# EAGLE design 16x16base (EAGLE 5.06)
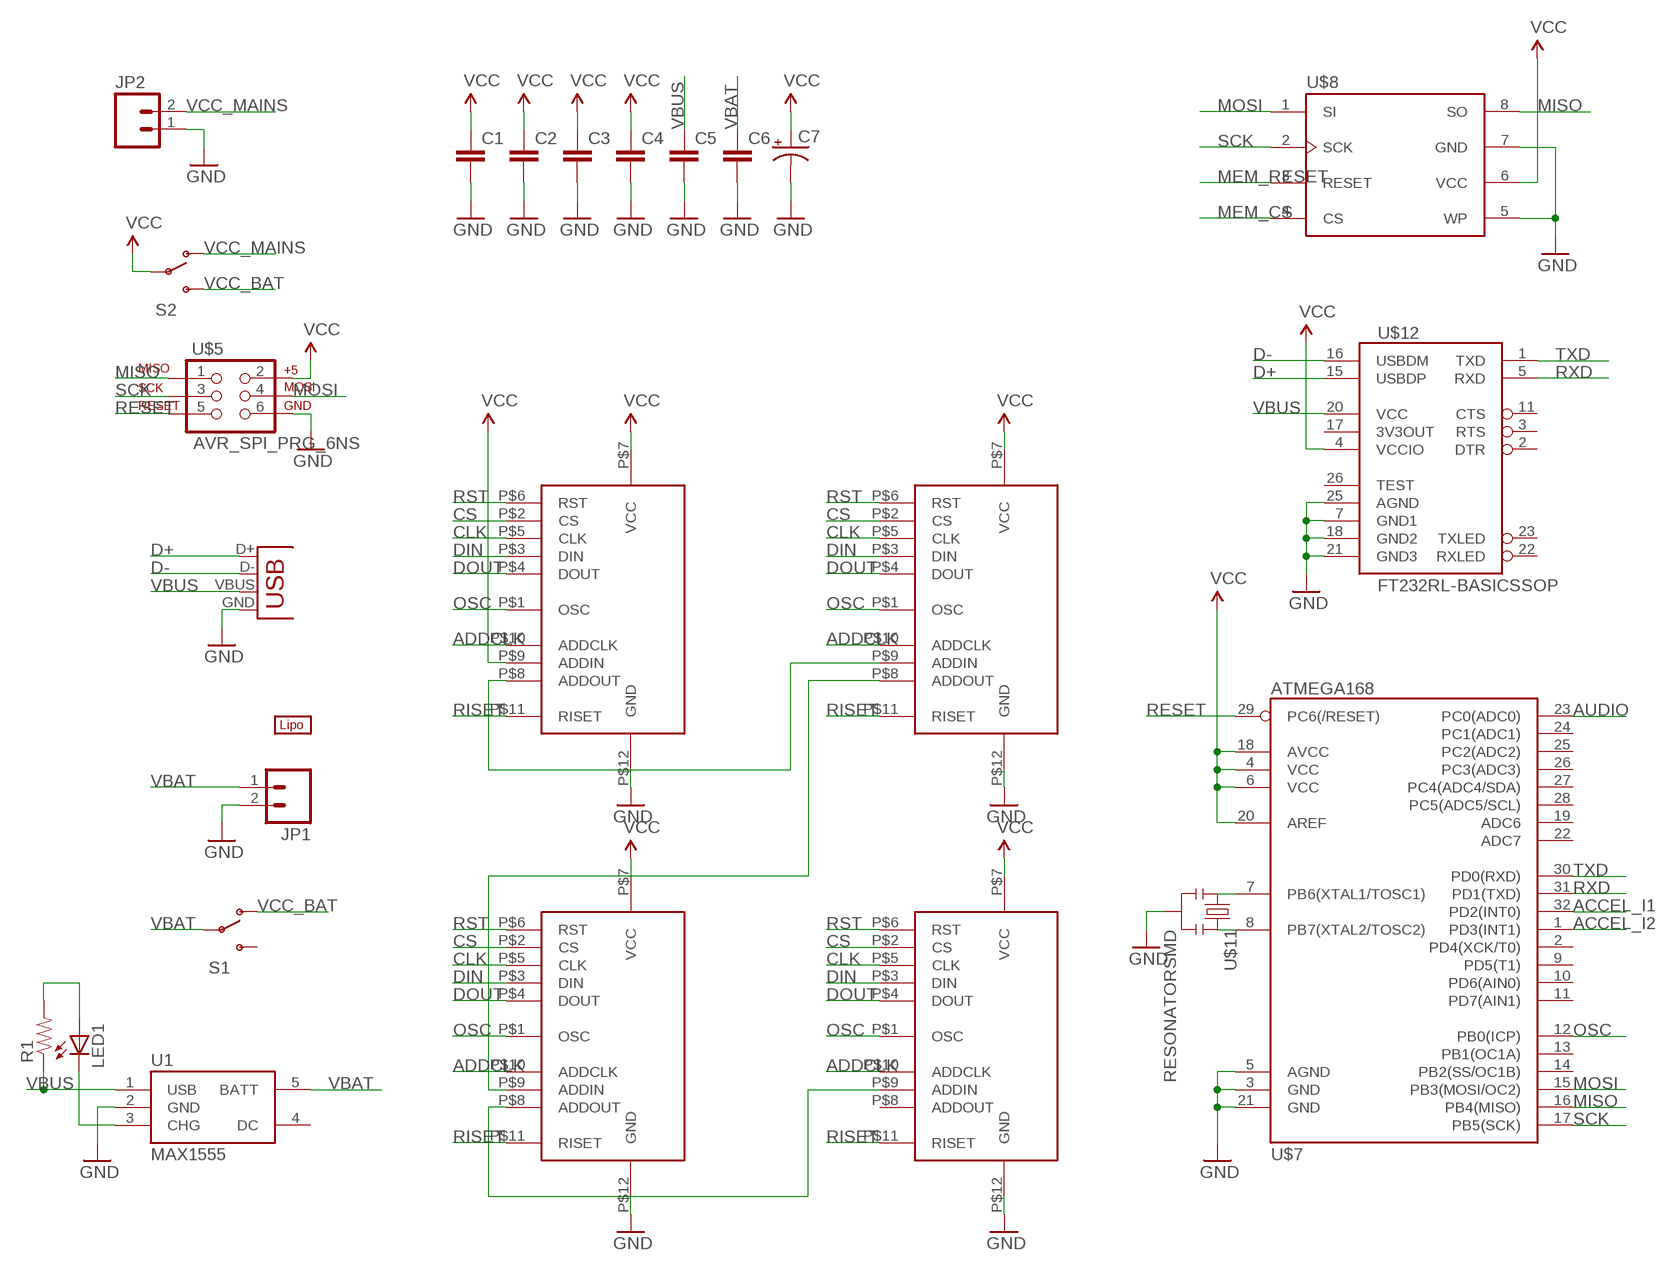
[diagram p0: schematic, sheet 1]

## Parts
C1  CAP0603  [0603]
C2  CAP0603  [0603]
C3  CAP0603  [0603]
C4  CAP0603  [0603]
C5  CAP0603  [0603]
C6  CAP0603  [0603]
C7  CAP_POL3528  [EIA3528]
JP1  M02-JST-2MM-SMT  [S2B-PH]
JP2  M02PTH  [1X02]
LED1  LED0603  [LED-0603]
R1  RESISTOR0603  [0603]
S1  SWITCH-SPSTSMD2  [SWITCH-SPDT-SMD]
S2  SWITCH-SPSTSMD2  [SWITCH-SPDT-SMD]
U1  MAX1555  [SOT23-5]
U$1  DISPLAY_TILE  [DISPLAY_TILE]
U$2  DISPLAY_TILE  [DISPLAY_TILE]
U$3  DISPLAY_TILE  [DISPLAY_TILE]
U$4  DISPLAY_TILE  [DISPLAY_TILE]
U$5  AVR_SPI_PRG_6NS  [2X3-NS]
U$6  LIPO-OUTLINE2000  [LIPO-2000]
U$7  ATMEGA168  [TQFP32-08]
U$8  ATMEL_DATA_FLASH  [SO08WIDE]
U$11  RESONATORSMD  [RESONATOR-SMD]
U$12  FT232RL-BASICSSOP  [SSOP28DB]
X1  USBSMD  [USB-MINIB]

## Nets
ACCEL_I1: U$7.32(PD2(INT0))
ACCEL_I2: U$7.1(PD3(INT1))
ADDCLK: U$1.P$10(ADDCLK) U$2.P$10(ADDCLK) U$3.P$10(ADDCLK) U$4.P$10(ADDCLK)
AUDIO: U$7.23(PC0(ADC0))
CLK: U$1.P$5(CLK) U$2.P$5(CLK) U$3.P$5(CLK) U$4.P$5(CLK)
CS: U$1.P$2(CS) U$2.P$2(CS) U$3.P$2(CS) U$4.P$2(CS)
D+: U$12.15(USBDP) X1.D+
D-: U$12.16(USBDM) X1.D-
DIN: U$1.P$3(DIN) U$2.P$3(DIN) U$3.P$3(DIN) U$4.P$3(DIN)
DOUT: U$1.P$4(DOUT) U$2.P$4(DOUT) U$3.P$4(DOUT) U$4.P$4(DOUT)
GND: C1.2 C2.2 C3.2 C4.2 C5.2 C6.2 C7.C(-) JP1.2 JP2.1 U1.2(GND) U$1.P$12(GND) U$2.P$12(GND) U$3.P$12(GND) U$4.P$12(GND) U$5.6 U$7.3(GND) U$7.5(AGND) U$7.21(GND) U$8.5(WP) U$8.7(GND) U$11.2 U$12.7(GND1) U$12.18(GND2) U$12.21(GND3) U$12.25(AGND) X1.GND
MEM_CS: U$8.4(CS)
MEM_RESET: U$8.3(RESET)
MISO: U$5.1 U$7.16(PB4(MISO)) U$8.8(SO)
MOSI: U$5.4 U$7.15(PB3(MOSI/OC2)) U$8.1(SI)
N$1: U$1.P$8(ADDOUT) U$2.P$9(ADDIN)
N$2: U$2.P$8(ADDOUT) U$3.P$9(ADDIN)
N$3: U$3.P$8(ADDOUT) U$4.P$9(ADDIN)
N$4: U$7.8(PB7(XTAL2/TOSC2)) U$11.3
N$5: LED1.C U1.3(CHG)
N$6: LED1.A R1.2
N$8: U$7.7(PB6(XTAL1/TOSC1)) U$11.1
OSC: U$1.P$1(OSC) U$2.P$1(OSC) U$3.P$1(OSC) U$4.P$1(OSC) U$7.12(PB0(ICP))
RESET: U$5.5 U$7.29(PC6(/RESET))
RISET: U$1.P$11(RISET) U$2.P$11(RISET) U$3.P$11(RISET) U$4.P$11(RISET)
RST: U$1.P$6(RST) U$2.P$6(RST) U$3.P$6(RST) U$4.P$6(RST)
RXD: U$7.31(PD1(TXD)) U$12.5(RXD)
SCK: U$5.3 U$7.17(PB5(SCK)) U$8.2(SCK)
TXD: U$7.30(PD0(RXD)) U$12.1(TXD)
VBAT: C6.1 JP1.1 S1.2(P) U1.5(BATT)
VBUS: C5.1 R1.1 U1.1(USB) U$12.20(VCC) X1.VBUS
VCC: C1.1 C2.1 C3.1 C4.1 C7.A(+) S2.2(P) U$1.P$7(VCC) U$1.P$9(ADDIN) U$2.P$7(VCC) U$3.P$7(VCC) U$4.P$7(VCC) U$5.2 U$7.4(VCC) U$7.6(VCC) U$7.18(AVCC) U$7.20(AREF) U$8.6(VCC) U$12.4(VCCIO)
VCC_BAT: S1.1(O) S2.3(S)
VCC_MAINS: JP2.2 S2.1(O)
Unconnected: S1.3(S) U1.4(DC) U$4.P$8(ADDOUT) U$7.2(PD4(XCK/T0)) U$7.9(PD5(T1)) U$7.10(PD6(AIN0)) U$7.11(PD7(AIN1)) U$7.13(PB1(OC1A)) U$7.14(PB2(SS/OC1B)) U$7.19(ADC6) U$7.22(ADC7) U$7.24(PC1(ADC1)) U$7.25(PC2(ADC2)) U$7.26(PC3(ADC3)) U$7.27(PC4(ADC4/SDA)) U$7.28(PC5(ADC5/SCL)) U$12.2(DTR) U$12.3(RTS) U$12.11(CTS) U$12.17(3V3OUT) U$12.22(RXLED) U$12.23(TXLED) U$12.26(TEST)

## Library data of the parts
C1-C6 = SparkFun:CAP: Capacitor Standard 0603 ceramic capacitor, and 0.1" leaded capacitor.
C7 = SparkFun:CAP_POL: Capacitor Polarized These are standard SMD and PTH capacitors. Normally 10uF, 47uF, and 100uF in electrolytic and tantalum varieties. Always verify the external diameter of the through hole cap, it varies with capacity, voltage, and manufacturer. The EIA devices should be standard.
JP1 JP2 = SparkFun:M02: Header 2 Standard 2-pin 0.1" header. Use with straight break away headers (SKU : PRT-00116), right angle break away headers (PRT-00553), swiss pins (PRT-00743), machine pins (PRT-00117), and female headers (PRT-00115). Molex polarized connector foot print use with SKU : PRT-08233 with associated crimp pins and housings.
LED1 = SparkFun:LED: LEDs Standard schematic elements and footprints for 5mm, 3mm, 1206, and 0603 sized LEDs. 5mm - Spark Fun Electronics SKU : COM-00529 (and others)
R1 = SparkFun:RESISTOR: Resistor Basic schematic elements and footprints for 0603, 1206, and PTH 1/10th watt (small) resistors.
S1 S2 = SparkFun:SWITCH-SPST: SPST Switch Simple slide switch. Spark Fun Electronics SKU : COM-00102
U1 = SparkFun:MAX1555: MAX1555 Lithium Charger IC SOT-23 Lithium Polymer charging IC. Schematic element and footprint proven. Spark Fun Electronics SKU : COM-00674
U$1-U$4 = john:DISPLAY_TILE
U$5 = SparkFun:AVR_SPI_PRG_6: AVR ISP 6 Pin This is the reduced ISP connector for AVR programming. Common on Arduino. This footprint will take up less PCB space and can be used with a 10-pin to 6-pin adapter such as SKU: BOB-08508
U$6 = SparkFun:LIPO-OUTLINE
U$7 = SparkFun:ATMEGA168
U$8 = SparkFun:ATMEL_DATA_FLASH: 16Mbit EEPROM DataFlash Footprint needs touching up. Spark Fun Electronics SKU : COM-00301
U$11 = SparkFun:RESONATOR: Resonator Small SMD resonator. This is the itty bitty 10/20MHz resonators with built in caps. CSTCE10M0G55 and CSTCE20M0V53. Footprint has been reviewed closely but hasn't been tested yet.
U$12 = SparkFun:FT232RL-BASIC: USB UART This is the simplified version of the FT232RL unit. Only what you need, nothing you don't. Spark Fun Electronics SKU : COM-00650
X1 = SparkFun:USB: USB Connectors USB-B-PTH is fully proven SKU : PRT-00139 USB-miniB is fully proven SKU : PRT-00587 USB-A-PCB is untested. USB-A-H is throughly reviewed, but untested. Spark Fun Electronics SKU : PRT-00437 USB-B-SMT is throughly reviewed, but untested. Needs silkscreen touching up. USB-A-S has not been used/tested USB-MB-H has not been used/tested

## Board
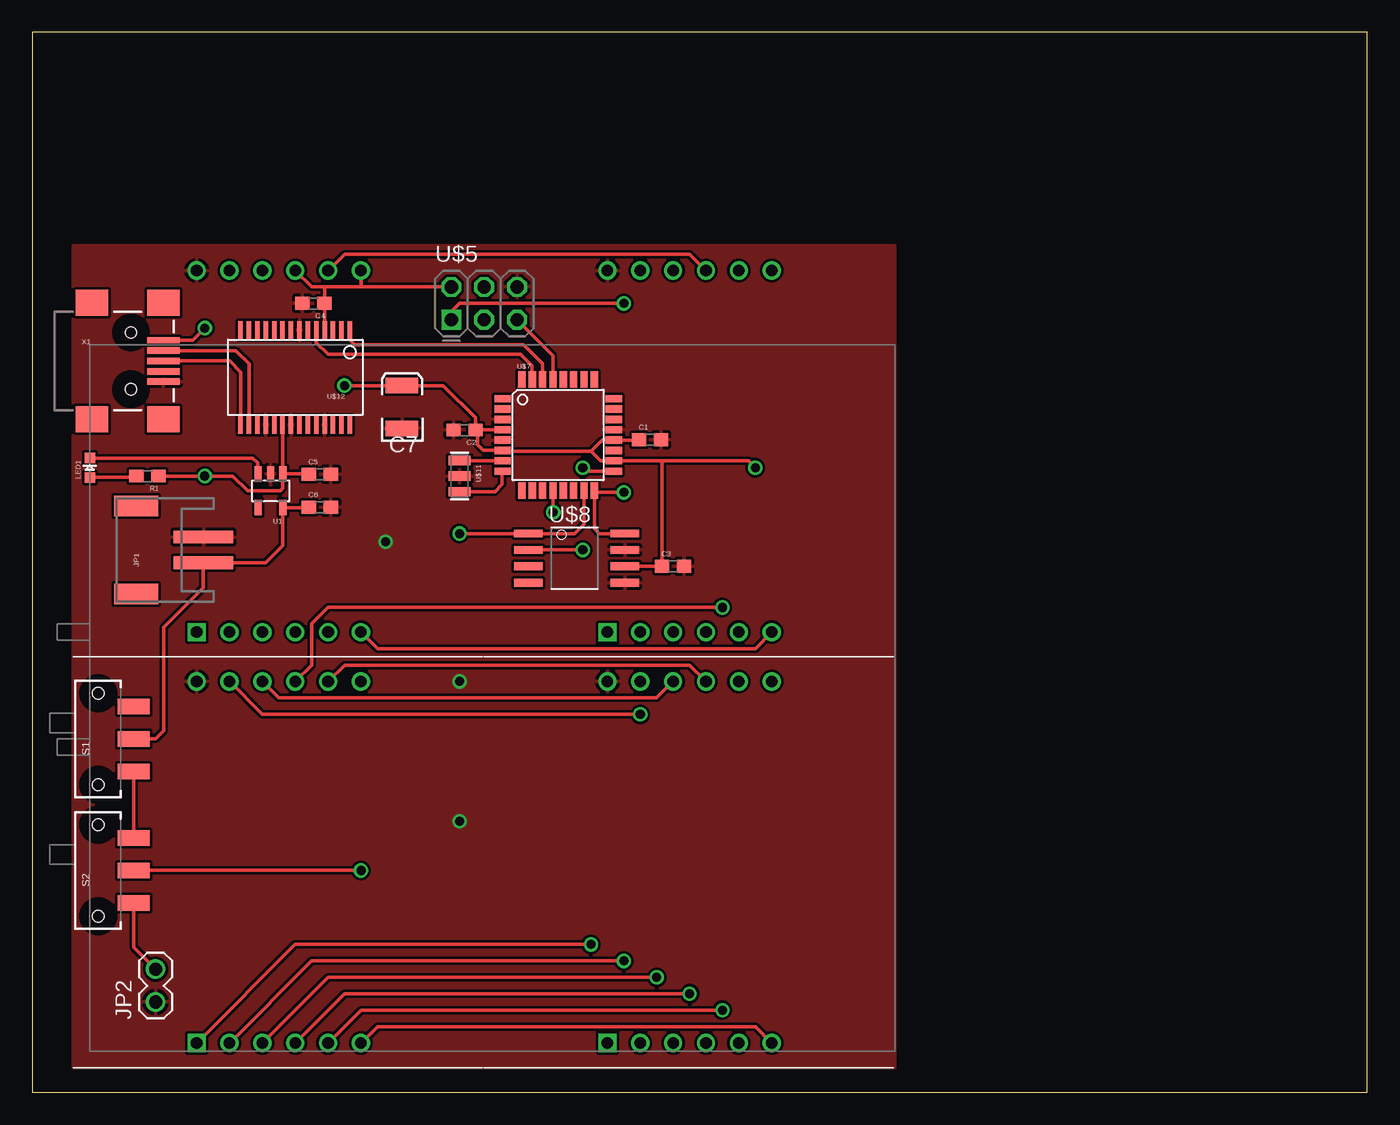
[diagram p1: board, top side]
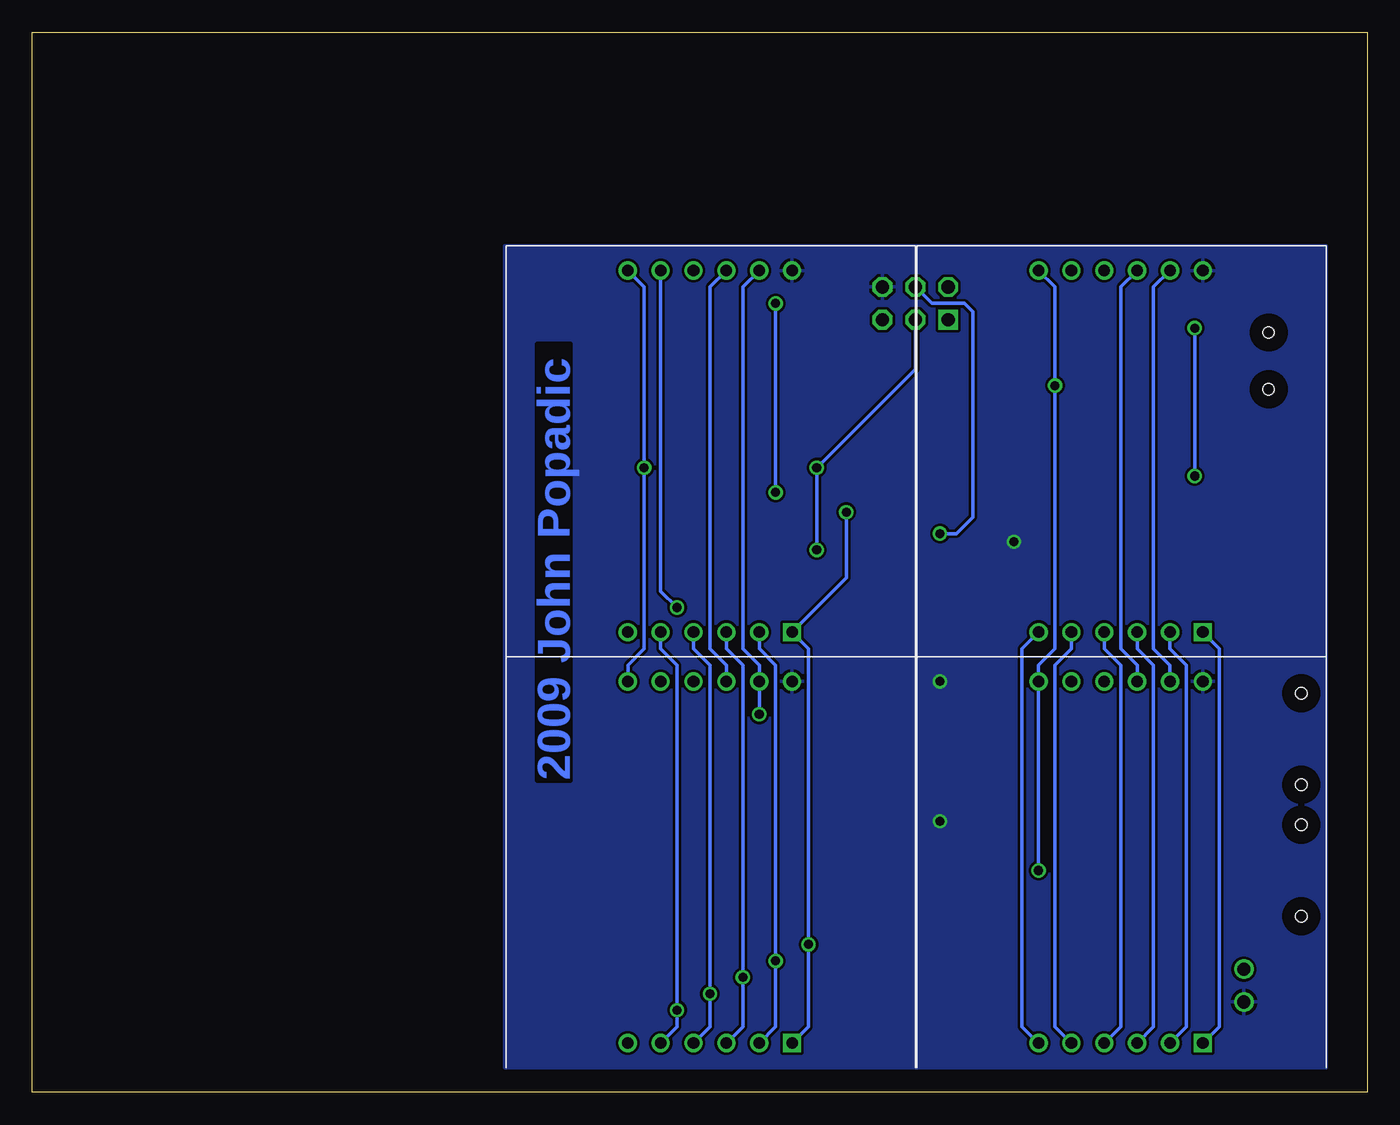
[diagram p2: board, bottom side, seen from below]

Size 103.17 x 81.91 mm. Coordinates in mm from the lower left corner, seen from the top.
Outline: 0,0 103.17,0 103.17,81.91 0,81.91 0,0
Copper layers (1*16): Top 0.035mm / dielectric 1.5mm / Bottom 0.035mm
Design rules "default": minimum track width 10mil, minimum drill 24mil, track to track 8mil, track to pad 8mil, pad to pad 8mil, via to via 8mil, smd to smd 8mil, copper to edge 40mil, drill to drill 8mil, minimum pad ring 10mil, minimum via ring 8mil, stop-mask expansion 4mil, vias tented up to drill 0mil, thermal gap 10mil

### Footprints (pad centres in the part's own frame; a part is rotated, then mirrored left to right if it is on the bottom)
0603 = smd 1.1 x 1: 1 -0.85,0; 2 0.85,0
EIA3528 = smd 1.2 x 2.5: A 1.65,0; C -1.65,0
S2B-PH = smd 1 x 4.6: 1 -1,-3.7; 2 1,-3.7 | smd 1.6 x 3.4: NC1 -3.4,1.5; NC2 3.4,1.5
1X02 = drill 1.016 round: 1 0,0; 2 2.54,0
LED-0603 = smd 0.8 x 0.8: A 0,-0.75; C 0,0.75
SWITCH-SPDT-SMD = smd 1.2 x 2.5: 1 -2.5,-2.75; 2 0,-2.75; 3 2.5,-2.75 | hole 0.9: -3.55,0; 3.55,0
SOT23-5 = smd 0.55 x 1.2: 1 -0.95,-1.3; 2 0,-1.3; 3 0.95,-1.3; 4 0.95,1.3; 5 -0.95,1.3
DISPLAY_TILE = drill 0.9 square: P$1 9.525,1.905 | drill 0.9 round: P$2 12.065,1.905; P$3 14.605,1.905; P$4 17.145,1.905; P$5 19.685,1.905; P$6 22.225,1.905; P$7 22.225,29.845; P$8 19.685,29.845; P$9 17.145,29.845; P$10 14.605,29.845; P$11 12.065,29.845; P$12 9.525,29.845
2X3-NS = drill 1.016 square: 1 -2.54,-1.27 | drill 1.016 octagon: 2 -2.54,1.27; 3 0,-1.27; 4 0,1.27; 5 2.54,-1.27; 6 2.54,1.27
TQFP32-08 = smd 1.27 x 0.559: 1 -4.293,2.8; 2 -4.293,2; 3 -4.293,1.2; 4 -4.293,0.4; 5 -4.293,-0.4; 6 -4.293,-1.2; 7 -4.293,-2; 8 -4.293,-2.8; 17 4.293,-2.8; 18 4.293,-2; 19 4.293,-1.2; 20 4.293,-0.4; 21 4.293,0.4; 22 4.293,1.2; 23 4.293,2; 24 4.293,2.8 | smd 0.559 x 1.27: 9 -2.8,-4.293; 10 -2,-4.293; 11 -1.2,-4.293; 12 -0.4,-4.293; 13 0.4,-4.293; 14 1.2,-4.293; 15 2,-4.293; 16 2.8,-4.293; 25 2.8,4.293; 26 2,4.293; 27 1.2,4.293; 28 0.4,4.293; 29 -0.4,4.293; 30 -1.2,4.293; 31 -2,4.293; 32 -2.8,4.293
SO08WIDE = smd 0.61 x 2.21: 1 -1.905,-3.569; 2 -0.635,-3.569; 3 0.635,-3.569; 4 1.905,-3.569; 5 1.905,3.886; 6 0.635,3.886; 7 -0.635,3.886; 8 -1.905,3.886
RESONATOR-SMD = smd 0.7 x 1.7: 1 -1.2,0; 2 0,0; 3 1.2,0
SSOP28DB = smd 0.348 x 1.397: 1 -4.225,-3.656; 2 -3.575,-3.656; 3 -2.925,-3.656; 4 -2.275,-3.656; 5 -1.625,-3.656; 6 -0.975,-3.656; 7 -0.325,-3.656; 8 0.325,-3.656; 9 0.975,-3.656; 10 1.625,-3.656; 11 2.275,-3.656; 12 2.925,-3.656; 13 3.575,-3.656; 14 4.225,-3.656; 15 4.225,3.656; 16 3.575,3.656; 17 2.925,3.656; 18 2.275,3.656; 19 1.625,3.656; 20 0.975,3.656; 21 0.325,3.656; 22 -0.325,3.656; 23 -0.975,3.656; 24 -1.625,3.656; 25 -2.275,3.656; 26 -2.925,3.656; 27 -3.575,3.656; 28 -4.225,3.656
USB-MINIB = smd 2.5 x 0.5: D+ 2.5,0; D- 2.5,0.8; GND 2.5,-1.6; ID 2.5,-0.8; VBUS 2.5,1.6 | smd 2.5 x 2: GND@1 -3,-4.5; GND@2 -3,4.5; GND@3 2.5,4.5; GND@4 2.5,-4.5 | hole 0.9: 0,2.2; 0,-2.2

### Placement (x,y rotation side)
C1  47.75,50.42 0 top
C2  33.4,51.18 180 top
C3  49.53,40.64 0 top
C4  21.72,60.96 180 top
C5  22.23,47.75 0 top
C6  22.23,45.21 0 top
C7  28.57,52.96 90 top
JP1  9.52,41.91 90 top
JP2  9.52,6.99 90 top
LED1  4.45,48.26 0 top
R1  8.89,47.62 180 top
S1  5.08,27.3 90 top
S2  5.08,17.14 90 top
U1  18.41,46.48 180 top
U$1  3.17,33.66 0 top
U$2  34.92,33.66 0 top
U$3  3.17,1.91 0 top
U$4  34.92,1.91 0 top
U$5  34.92,60.96 0 top
U$6  4.45,3.17 0 top
U$7  40.64,50.8 0 top
U$8  41.91,41.27 270 top
U$11  33.02,47.62 270 top
U$12  20.32,55.25 180 top
X1  7.62,56.52 0 top

### Tracks (layer width: path | path; a pad name or v marks a point on that pad's centre or on a via)
ADDCLK
  Top 0.254: U$3.P$10 19.05,30.48 48.26,30.48 U$4.P$10
  Bottom 0.254: U$1.P$10 19.05,62.23 19.05,34.29 17.78,33.02 U$3.P$10 | U$2.P$10 50.8,62.23 50.8,34.29 49.53,33.02 U$4.P$10
CLK  (via drill 0.7)
  Top 0.254: U$3.P$5 25.4,6.35 v53.34,6.35
  Bottom 0.254: U$1.P$5 22.86,34.29 24.13,33.02 24.13,5.08 U$3.P$5 | U$4.P$5 53.34,5.08 v53.34,6.35 53.34,33.02 54.61,34.29 U$2.P$5
CS  (via drill 0.7)
  Top 0.254: U$3.P$2 21.59,10.16 v45.72,10.16
  Bottom 0.254: U$1.P$2 15.24,34.29 13.97,33.02 13.97,5.08 U$3.P$2 | U$4.P$2 45.72,5.08 v45.72,10.16 45.72,33.02 46.99,34.29 U$2.P$2
D+
  Top 0.254: X1.D+ 15.24,56.52 16.09,55.66 U$12.15
D-
  Top 0.254: X1.D- 15.71,57.31 16.75,56.28 U$12.16
DIN  (via drill 0.7)
  Top 0.254: v48.26,8.89 22.86,8.89 U$3.P$3
  Bottom 0.254: U$3.P$3 16.51,5.08 16.51,33.02 17.78,34.29 U$1.P$3 | U$4.P$3 48.26,5.08 v48.26,8.89 48.26,33.02 49.53,34.29 U$2.P$3
DOUT  (via drill 0.7)
  Top 0.254: v50.8,7.62 24.13,7.62 U$3.P$4
  Bottom 0.254: U$1.P$4 20.32,34.29 19.05,33.02 19.05,5.08 U$3.P$4 | U$4.P$4 50.8,5.08 v50.8,7.62 50.8,33.02 52.07,34.29 U$2.P$4
GND  (via drill 0.7)
  other vias: 27.3,42.55 33.02,20.96 33.02,31.75
  pour Top: 3.17,65.41 3.17,1.91 66.67,1.91 66.67,65.41
  pour Bottom: 3.17,65.41 3.17,1.91 66.67,1.91 66.67,65.41
MISO  (via drill 0.7)
  Top 0.254: U$8.8 43.81,43.18 43.44,43.55 U$7.16 43.59,46.36 v45.72,46.36 | U$5.1 32.38,60.33 33.02,60.96 v45.72,60.96
  Bottom 0.254: v45.72,46.36 v45.72,60.96
MOSI  (via drill 0.7)
  Top 0.254: U$7.15 42.64,43.91 41.91,43.18 U$8.1 v33.02,43.18
  Bottom 0.254: U$5.4 33.66,60.96 31.12,60.96 30.48,60.33 30.48,44.45 31.75,43.18 v33.02,43.18
N$1
  Top 0.254: U$1.P$8 24.13,64.77 50.8,64.77 U$2.P$9
N$2  (via drill 0.7)
  Top 0.254: U$3.P$9 21.59,33.02 21.59,36.2 22.86,37.47 v53.34,37.47
  Bottom 0.254: v53.34,37.47 54.61,38.73 U$2.P$8
N$3
  Top 0.254: U$3.P$8 24.13,33.02 50.8,33.02 U$4.P$9
N$4
  Top 0.254: U$11.3 35.76,46.43 36.32,46.99 36.32,47.98 U$7.8
N$5
  Top 0.254: LED1.C 17.03,49.01 17.4,48.64 17.4,47.85 U1.3
N$6
  Top 0.254: LED1.A 7.92,47.51 R1.2
N$8
  Top 0.254: U$7.7 33.05,48.8 U$11.1
OSC  (via drill 0.7)
  Top 0.254: U$3.P$1 20.32,11.43 v43.18,11.43 | U$7.12 40.24,44.85 v40.26,44.83
  Bottom 0.254: U$4.P$1 43.18,5.08 v43.18,11.43 43.18,34.29 U$2.P$1 40.26,39.75 v40.26,44.83 | U$1.P$1 11.43,34.29 11.43,5.08 U$3.P$1
RESET
  Top 0.254: U$7.29 40.24,56.91 U$5.5
RISET  (via drill 0.7)
  Top 0.254: U$3.P$11 17.78,29.21 v46.99,29.21
  Bottom 0.254: U$2.P$11 48.26,62.23 48.26,34.29 46.99,33.02 U$4.P$11 v46.99,29.21 | U$1.P$11 16.51,62.23 16.51,34.29 15.24,33.02 U$3.P$11
RST
  Top 0.254: U$4.P$6 55.88,5.08 26.67,5.08 U$3.P$6 | U$2.P$6 55.88,34.29 26.67,34.29 U$1.P$6
  Bottom 0.254: U$3.P$6 26.67,5.08 26.67,34.29 U$1.P$6
RXD
  Top 0.254: U$12.5 21.95,57.94 22.86,57.02 37.72,57.02 38.61,56.13 38.61,55.12 U$7.31
SCK  (via drill 0.7)
  Top 0.254: U$7.17 42.8,48 v42.54,48.26 | U$8.2 v42.54,41.91
  Bottom 0.254: U$5.3 34.92,55.88 v42.54,48.26 v42.54,41.91
TXD
  Top 0.254: U$12.1 24.55,58.13 24.89,57.79 25.66,57.79 37.97,57.79 39.44,56.32 U$7.30
VBAT
  Top 0.254: S1.2 9.52,27.3 10.16,27.94 10.16,35.94 13.21,38.99 13.21,40.89 JP1.1 18.05,40.91 19.37,42.23 U1.5 21.35,45.18 C6.1
VBUS  (via drill 0.7)
  Top 0.254: U$12.20 19.35,47.8 U1.1 | R1.1 v13.34,47.62 15.49,47.62 16.64,46.48 19.18,46.48 19.37,46.67 U1.1 | X1.VBUS 12.39,58.12 v13.34,59.05 | U1.1 21.35,47.78 C5.1
  Bottom 0.254: v13.34,47.62 v13.34,59.05
VCC  (via drill 0.7)
  Top 0.254: U$1.P$9 21.59,62.23 22.61,62.23 | 25.4,62.23 22.61,62.23 | U$1.P$7 25.4,62.23 | 25.4,62.23 U$5.2 | 43.18,49.53 36.42,49.53 U$7.6 34.85,49.6 34.42,50.04 34.42,51.02 C2.1 | 43.18,49.53 44.05,50.4 U$7.20 46.88,50.4 C1.1 | U$7.18 43.91,48.8 43.18,49.53 | U$12.4 22.61,58.9 22.61,62.23 | S2.2 v25.4,17.14 | C3.1 U$8.6 | C3.1 48.89,40.43 | U$7.4 36.33,51.18 C2.1 | 22.61,62.23 22.61,60.96 C4.1 | U$7.18 55.34,48.8 v55.88,48.26 | U$7.18 48.68,48.8 C3.1 | C2.1 34.25,52.11 31.75,54.61 | v24.13,54.61 31.75,54.61 | 31.75,54.61 C7.A
  Bottom 0.254: U$2.P$7 55.88,62.23 v55.88,48.26 55.88,34.29 57.15,33.02 U$4.P$7 | U$1.P$7 24.13,62.23 v24.13,54.61 24.13,34.29 25.4,33.02 U$3.P$7 v25.4,17.14
VCC_BAT
  Top 0.254: S2.3 S1.1
VCC_MAINS
  Top 0.254: S2.1 7.83,11.22 JP2.2

### Text on the board
Bottom: 2009 John Popadic